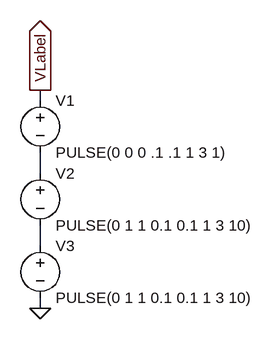
[diagram p0: schematic OutputLabels.asc]
OutputLabels.asc, the LTspice schematic file:
Version 4

SHEET 1 880 680

WIRE 64 64 64 48

FLAG 64 48 VLabel

IOPIN 64 48 Out

SYMBOL voltage 64 48 R0

WINDOW 123 0 0 Left 2

WINDOW 39 0 0 Left 2

SYMATTR InstName V1

SYMATTR Value PULSE(0 0 0 .1 .1 1 3 1)

WIRE 64 176 64 144
SYMBOL voltage 64 160 R0
WINDOW 123 0 0 Left 2
WINDOW 39 0 0 Left 2
SYMATTR InstName V2
SYMATTR Value PULSE(0 1 1 0.1 0.1 1 3 10)
WIRE 64 288 64 256
SYMBOL voltage 64 272 R0
WINDOW 123 0 0 Left 2
WINDOW 39 0 0 Left 2
SYMATTR InstName V3
SYMATTR Value PULSE(0 1 1 0.1 0.1 1 3 10)
WIRE 64 384 64 368
FLAG 64 384 0

The netlist it stands for:
* OutputLabels.asc
V1 VLabel N001 PULSE(0 0 0 .1 .1 1 3 1)
V2 N001 N002 PULSE(0 1 1 0.1 0.1 1 3 10)
V3 N002 0 PULSE(0 1 1 0.1 0.1 1 3 10)
.backanno
.end